# EAGLE design qfp160_socket (EAGLE 9.6.2)
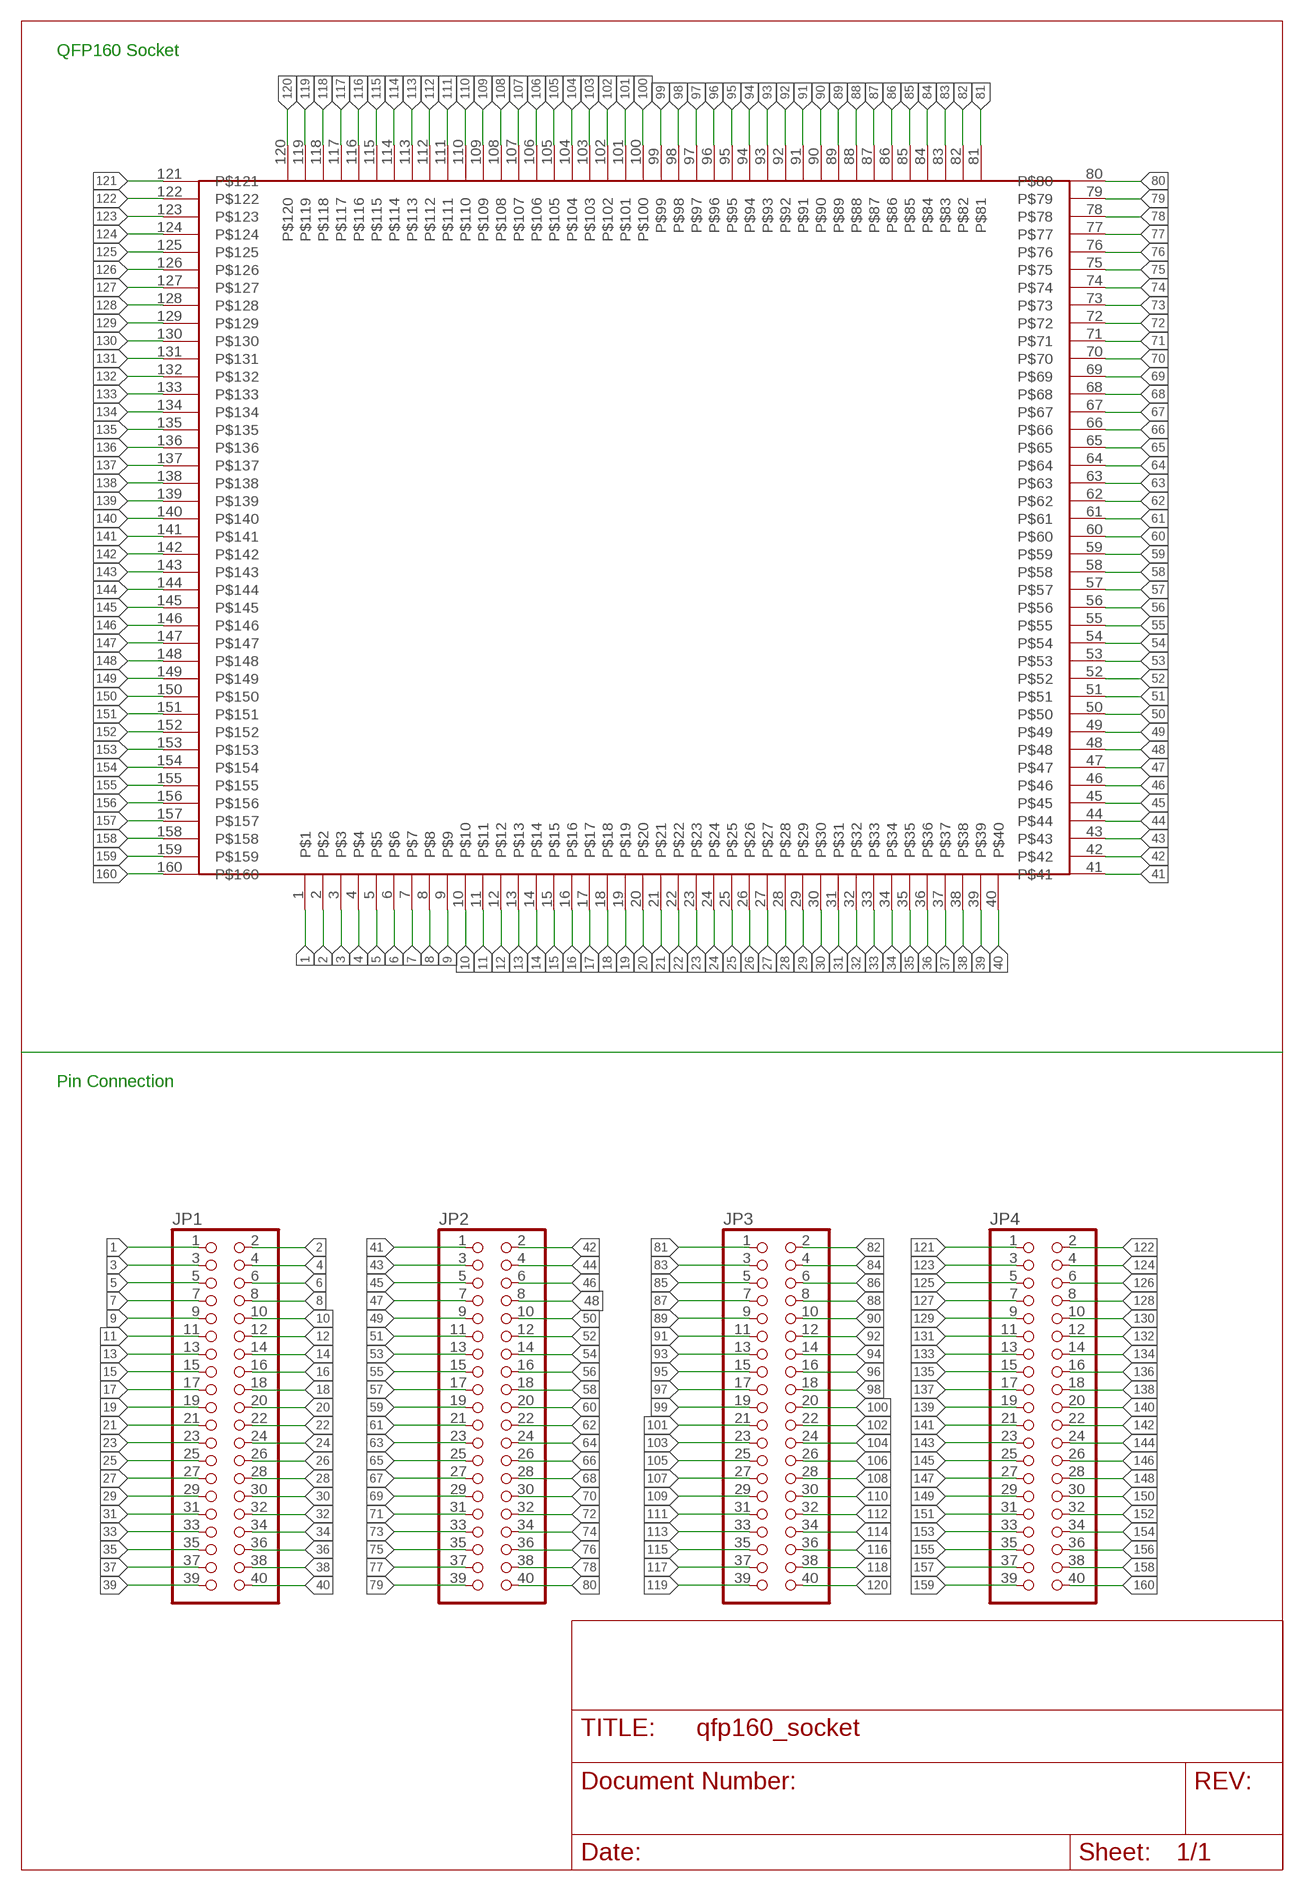
[diagram p0: schematic, sheet 1]

## Parts
JP1  PINHD-2X20  [2X20]
JP2  PINHD-2X20  [2X20]
JP3  PINHD-2X20  [2X20]
JP4  PINHD-2X20  [2X20]
U$1  QFP160_SOCKET  [QFP160_SOCKET]

## Nets
1: JP1.1 U$1.1
2: JP1.2 U$1.2
3: JP1.3 U$1.3
4: JP1.4 U$1.4
5: JP1.5 U$1.5
6: JP1.6 U$1.6
7: JP1.7 U$1.7
8: JP1.8 U$1.8
9: JP1.9 U$1.9
10: JP1.10 U$1.10
11: JP1.11 U$1.11
12: JP1.12 U$1.12
13: JP1.13 U$1.13
14: JP1.14 U$1.14
15: JP1.15 U$1.15
16: JP1.16 U$1.16
17: JP1.17 U$1.17
18: JP1.18 U$1.18
19: JP1.19 U$1.19
20: JP1.20 U$1.20
21: JP1.21 U$1.21
22: JP1.22 U$1.22
23: JP1.23 U$1.23
24: JP1.24 U$1.24
25: JP1.25 U$1.25
26: JP1.26 U$1.26
27: JP1.27 U$1.27
28: JP1.28 U$1.28
29: JP1.29 U$1.29
30: JP1.30 U$1.30
31: JP1.31 U$1.31
32: JP1.32 U$1.32
33: JP1.33 U$1.33
34: JP1.34 U$1.34
35: JP1.35 U$1.35
36: JP1.36 U$1.36
37: JP1.37 U$1.37
38: JP1.38 U$1.38
39: JP1.39 U$1.39
40: JP1.40 U$1.40
41: JP2.1 U$1.41
42: JP2.2 U$1.42
43: JP2.3 U$1.43
44: JP2.4 U$1.44
45: JP2.5 U$1.45
46: JP2.6 U$1.46
47: JP2.7 U$1.47
48: JP2.8 U$1.48
49: JP2.9 U$1.49
50: JP2.10 U$1.50
51: JP2.11 U$1.51
52: JP2.12 U$1.52
53: JP2.13 U$1.53
54: JP2.14 U$1.54
55: JP2.15 U$1.55
56: JP2.16 U$1.56
57: JP2.17 U$1.57
58: JP2.18 U$1.58
59: JP2.19 U$1.59
60: JP2.20 U$1.60
61: JP2.21 U$1.61
62: JP2.22 U$1.62
63: JP2.23 U$1.63
64: JP2.24 U$1.64
65: JP2.25 U$1.65
66: JP2.26 U$1.66
67: JP2.27 U$1.67
68: JP2.28 U$1.68
69: JP2.29 U$1.69
70: JP2.30 U$1.70
71: JP2.31 U$1.71
72: JP2.32 U$1.72
73: JP2.33 U$1.73
74: JP2.34 U$1.74
75: JP2.35 U$1.75
76: JP2.36 U$1.76
77: JP2.37 U$1.77
78: JP2.38 U$1.78
79: JP2.39 U$1.79
80: JP2.40 U$1.80
81: JP3.1 U$1.81
82: JP3.2 U$1.82
83: JP3.3 U$1.83
84: JP3.4 U$1.84
85: JP3.5 U$1.85
86: JP3.6 U$1.86
87: JP3.7 U$1.87
88: JP3.8 U$1.88
89: JP3.9 U$1.89
90: JP3.10 U$1.90
91: JP3.11 U$1.91
92: JP3.12 U$1.92
93: JP3.13 U$1.93
94: JP3.14 U$1.94
95: JP3.15 U$1.95
96: JP3.16 U$1.96
97: JP3.17 U$1.97
98: JP3.18 U$1.98
99: JP3.19 U$1.99
100: JP3.20 U$1.100
101: JP3.21 U$1.101
102: JP3.22 U$1.102
103: JP3.23 U$1.103
104: JP3.24 U$1.104
105: JP3.25 U$1.105
106: JP3.26 U$1.106
107: JP3.27 U$1.107
108: JP3.28 U$1.108
109: JP3.29 U$1.109
110: JP3.30 U$1.110
111: JP3.31 U$1.111
112: JP3.32 U$1.112
113: JP3.33 U$1.113
114: JP3.34 U$1.114
115: JP3.35 U$1.115
116: JP3.36 U$1.116
117: JP3.37 U$1.117
118: JP3.38 U$1.118
119: JP3.39 U$1.119
120: JP3.40 U$1.120
121: JP4.1 U$1.121
122: JP4.2 U$1.122
123: JP4.3 U$1.123
124: JP4.4 U$1.124
125: JP4.5 U$1.125
126: JP4.6 U$1.126
127: JP4.7 U$1.127
128: JP4.8 U$1.128
129: JP4.9 U$1.129
130: JP4.10 U$1.130
131: JP4.11 U$1.131
132: JP4.12 U$1.132
133: JP4.13 U$1.133
134: JP4.14 U$1.134
135: JP4.15 U$1.135
136: JP4.16 U$1.136
137: JP4.17 U$1.137
138: JP4.18 U$1.138
139: JP4.19 U$1.139
140: JP4.20 U$1.140
141: JP4.21 U$1.141
142: JP4.22 U$1.142
143: JP4.23 U$1.143
144: JP4.24 U$1.144
145: JP4.25 U$1.145
146: JP4.26 U$1.146
147: JP4.27 U$1.147
148: JP4.28 U$1.148
149: JP4.29 U$1.149
150: JP4.30 U$1.150
151: JP4.31 U$1.151
152: JP4.32 U$1.152
153: JP4.33 U$1.153
154: JP4.34 U$1.154
155: JP4.35 U$1.155
156: JP4.36 U$1.156
157: JP4.37 U$1.157
158: JP4.38 U$1.158
159: JP4.39 U$1.159
160: JP4.40 U$1.160

## Notes on the sheet
- QFP160 Socket
- Pin Connection

## Library data of the parts
JP1-JP4 = pinhead:PINHD-2X20: PIN HEADER
U$1 = qfp160:QFP160_SOCKET

## Board
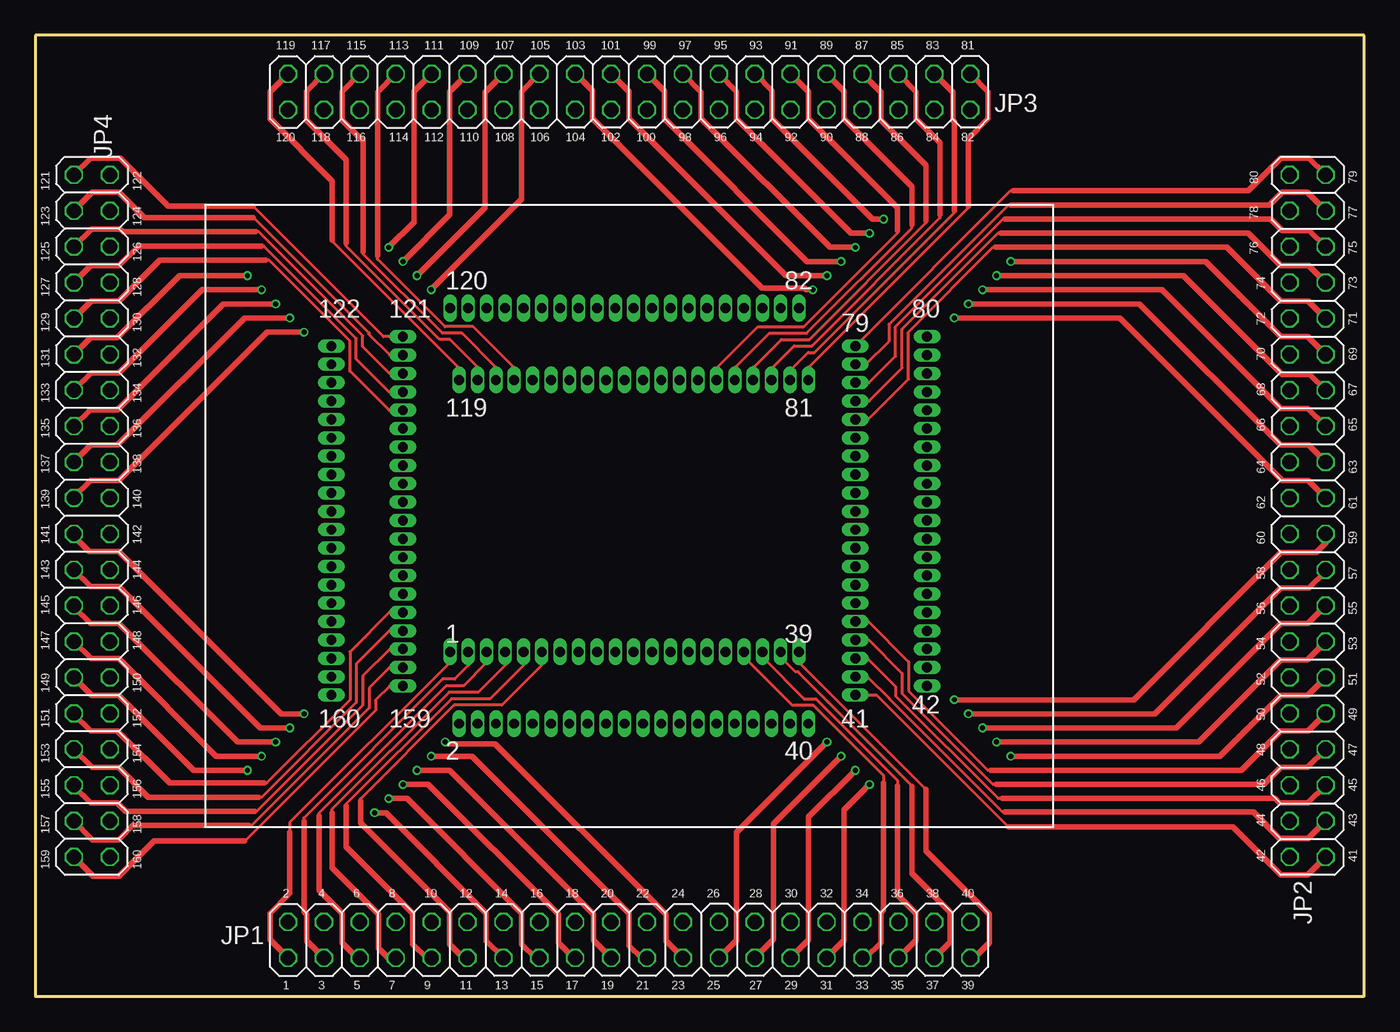
[diagram p1: board, top side]
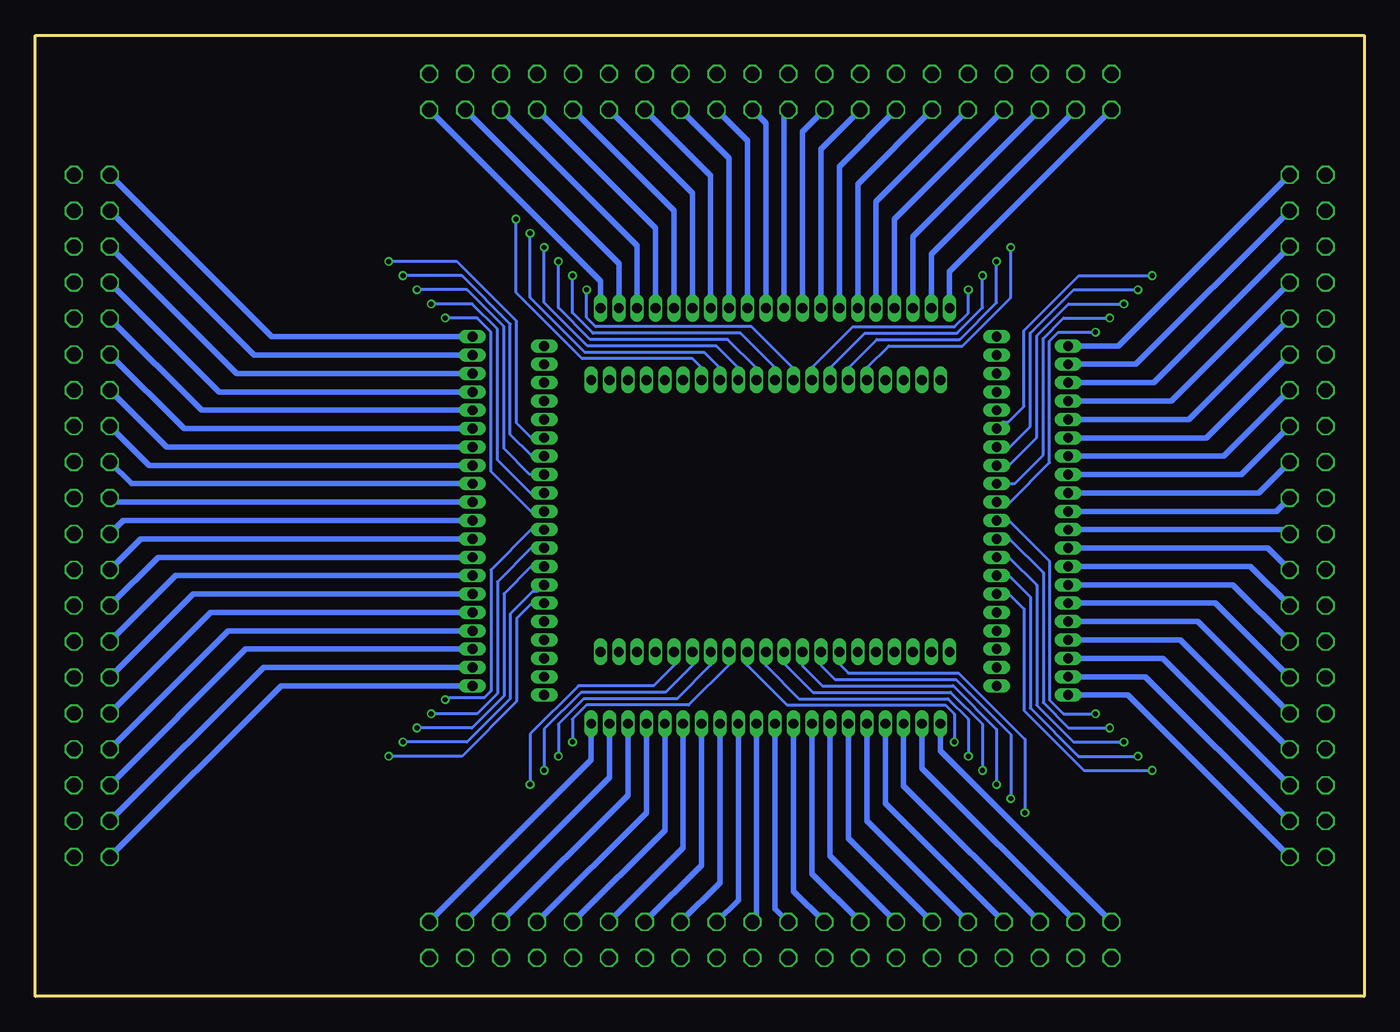
[diagram p2: board, bottom side, seen from below]

Size 94 x 68 mm. Coordinates in mm from the lower left corner, seen from the top.
Outline: 0,68 0,0 94,0 94,68 0,68
Copper layers (1*16): Top 0.035mm / dielectric 1.5mm / Bottom 0.035mm
Design rules "default *": minimum track width 6mil, minimum drill 0.35mm, track to track 10mil, track to pad 10mil, pad to pad 10mil, via to via 10mil, smd to smd 10mil, copper to edge 40mil, drill to drill 6mil, minimum pad ring 0.13mm, minimum via ring 0.13mm, stop-mask expansion 2mil, vias tented up to drill 0mil, thermal gap 10mil

### Footprints (pad centres in the part's own frame; a part is rotated, then mirrored left to right if it is on the bottom)
2X20 = drill 1.016 octagon: 1 -24.13,-1.27; 2 -24.13,1.27; 3 -21.59,-1.27; 4 -21.59,1.27; 5 -19.05,-1.27; 6 -19.05,1.27; 7 -16.51,-1.27; 8 -16.51,1.27; 9 -13.97,-1.27; 10 -13.97,1.27; 11 -11.43,-1.27; 12 -11.43,1.27; 13 -8.89,-1.27; 14 -8.89,1.27; 15 -6.35,-1.27; 16 -6.35,1.27; 17 -3.81,-1.27; 18 -3.81,1.27; 19 -1.27,-1.27; 20 -1.27,1.27; 21 1.27,-1.27; 22 1.27,1.27; 23 3.81,-1.27; 24 3.81,1.27; 25 6.35,-1.27; 26 6.35,1.27; 27 8.89,-1.27; 28 8.89,1.27; 29 11.43,-1.27; 30 11.43,1.27; 31 13.97,-1.27; 32 13.97,1.27; 33 16.51,-1.27; 34 16.51,1.27; 35 19.05,-1.27; 36 19.05,1.27; 37 21.59,-1.27; 38 21.59,1.27; 39 24.13,-1.27; 40 24.13,1.27
QFP160_SOCKET = drill 0.7 pad 0.7 long: 1 -12.675,-9.62; 2 -12.025,-14.7; 3 -11.375,-9.62; 4 -10.725,-14.7; 5 -10.075,-9.62; 6 -9.425,-14.7; 7 -8.775,-9.62; 8 -8.125,-14.7; 9 -7.475,-9.62; 10 -6.825,-14.7; 11 -6.175,-9.62; 12 -5.525,-14.7; 13 -4.875,-9.62; 14 -4.225,-14.7; 15 -3.575,-9.62; 16 -2.925,-14.7; 17 -2.275,-9.62; 18 -1.625,-14.7; 19 -0.975,-9.62; 20 -0.325,-14.7; 21 0.325,-9.62; 22 0.975,-14.7; 23 1.625,-9.62; 24 2.275,-14.7; 25 2.925,-9.62; 26 3.575,-14.7; 27 4.225,-9.62; 28 4.875,-14.7; 29 5.525,-9.62; 30 6.175,-14.7; 31 6.825,-9.62; 32 7.475,-14.7; 33 8.125,-9.62; 34 8.775,-14.7; 35 9.425,-9.62; 36 10.075,-14.7; 37 10.725,-9.62; 38 11.375,-14.7; 39 12.025,-9.62; 40 12.675,-14.7; 41 16,-12.675; 42 21.08,-12.025; 43 16,-11.375; 44 21.08,-10.725; 45 16,-10.075; 46 21.08,-9.425; 47 16,-8.775; 48 21.08,-8.125; 49 16,-7.475; 50 21.08,-6.825; 51 16,-6.175; 52 21.08,-5.525; 53 16,-4.875; 54 21.08,-4.225; 55 16,-3.575; 56 21.08,-2.925; 57 16,-2.275; 58 21.08,-1.625; 59 16,-0.975; 60 21.08,-0.325; 61 16,0.325; 62 21.08,0.975; 63 16,1.625; 64 21.08,2.275; 65 16,2.925; 66 21.08,3.575; 67 16,4.225; 68 21.08,4.875; 69 16,5.525; 70 21.08,6.175; 71 16,6.825; 72 21.08,7.475; 73 16,8.125; 74 21.08,8.775; 75 16,9.425; 76 21.08,10.075; 77 16,10.725; 78 21.08,11.375; 79 16,12.025; 80 21.08,12.675; 81 12.675,9.62; 82 12.025,14.7; 83 11.375,9.62; 84 10.725,14.7; 85 10.075,9.62; 86 9.425,14.7; 87 8.775,9.62; 88 8.125,14.7; 89 7.475,9.62; 90 6.825,14.7; 91 6.175,9.62; 92 5.525,14.7; 93 4.875,9.62; 94 4.225,14.7; 95 3.575,9.62; 96 2.925,14.7; 97 2.275,9.62; 98 1.625,14.7; 99 0.975,9.62; 100 0.325,14.7; 101 -0.325,9.62; 102 -0.975,14.7; 103 -1.625,9.62; 104 -2.275,14.7; 105 -2.925,9.62; 106 -3.575,14.7; 107 -4.225,9.62; 108 -4.875,14.7; 109 -5.525,9.62; 110 -6.175,14.7; 111 -6.825,9.62; 112 -7.475,14.7; 113 -8.125,9.62; 114 -8.775,14.7; 115 -9.425,9.62; 116 -10.075,14.7; 117 -10.725,9.62; 118 -11.375,14.7; 119 -12.025,9.62; 120 -12.675,14.7; 121 -16,12.675; 122 -21.06,12.025; 123 -16,11.375; 124 -21.06,10.725; 125 -16,10.075; 126 -21.06,9.425; 127 -16,8.775; 128 -21.06,8.125; 129 -16,7.475; 130 -21.06,6.825; 131 -16,6.175; 132 -21.06,5.525; 133 -16,4.875; 134 -21.06,4.225; 135 -16,3.575; 136 -21.06,2.925; 137 -16,2.275; 138 -21.06,1.625; 139 -16,0.975; 140 -21.06,0.325; 141 -16,-0.325; 142 -21.06,-0.975; 143 -16,-1.625; 144 -21.06,-2.275; 145 -16,-2.925; 146 -21.06,-3.575; 147 -16,-4.225; 148 -21.06,-4.875; 149 -16,-5.525; 150 -21.06,-6.175; 151 -16,-6.825; 152 -21.06,-7.475; 153 -16,-8.125; 154 -21.06,-8.775; 155 -16,-9.425; 156 -21.06,-10.075; 157 -16,-10.725; 158 -21.06,-11.375; 159 -16,-12.025; 160 -21.06,-12.675

### Placement (x,y rotation side)
JP1  42,4 0 top
JP2  90,34 90 top
JP3  42,64 180 top
JP4  4,34 270 top
U$1  42,34 0 top

### Tracks (layer width: path | path; a pad name or v marks a point on that pad's centre or on a via)
1
  Top 0.2: U$1.1 29.32,23.64 18,12.32 18,11.6
  Top 0.4: JP1.1 16.6,4 16.6,5.9 18,7.3 18,11.6
2
  Bottom 0.4: U$1.2 29.98,17.38 JP1.2
3
  Top 0.2: U$1.3 30.66,24.35 30.66,23.45 29.67,22.47 28.82,22.47 19,12.64 19,12.4
  Top 0.4: JP1.3 19.2,3.94 19.2,5.8 19,6 19,12.4
4
  Bottom 0.4: U$1.4 31.27,16.14 JP1.4
5
  Top 0.2: U$1.5 31.86,24.31 31.86,23.55 30.28,21.98 29.06,21.98 20.09,13 20.09,12.77
  Top 0.4: JP1.5 22.77,2.73 21.7,3.8 21.7,5.9 20.09,7.51 20.09,12.77
6
  Bottom 0.4: U$1.6 32.58,14.89 JP1.6
7
  Top 0.2: U$1.7 33.26,24.35 33.26,23.45 31.33,21.52 29.25,21.52 21,13.27 21,13
  Top 0.4: JP1.7 24.97,2.73 24.3,3.4 24.3,5.8 21,9.1 21,13
8
  Bottom 0.4: U$1.8 33.88,13.66 JP1.8
9
  Top 0.2: U$1.9 34.52,23.42 32.17,21.07 29.44,21.07 22,13.63 22,13.5 22,13.48
  Top 0.4: JP1.9 27.67,2.73 26.7,3.7 26.7,5.9 22,10.6 22,13.48
10
  Bottom 0.4: U$1.10 35.17,12.41 JP1.10
11
  Top 0.2: U$1.11 35.83,23.43 33.01,20.61 29.63,20.61 23,13.98 23,13.84
  Top 0.4: JP1.11 30.27,2.73 29.3,3.7 29.3,6 23,12.3 23,13.84
12
  Bottom 0.4: U$1.12 36.48,11.18 JP1.12
13  (via drill 0.35)
  Top 0.4: v24,13 24.8,13 31.9,5.9 31.9,3.94 JP1.13
  Bottom 0.2: U$1.13 37.12,23.52 36.49,22.88 28.69,22.88 24,18.2 v24,13
14
  Bottom 0.4: U$1.14 37.77,9.93 JP1.14
15  (via drill 0.35)
  Top 0.4: v25,14 26.3,14 34.4,5.9 34.4,3.7 35.37,2.73 JP1.15
  Bottom 0.2: U$1.15 38.42,23.42 37.43,22.43 28.88,22.43 25,18.55 v25,14
16
  Bottom 0.4: U$1.16 39.08,8.7 JP1.16
17  (via drill 0.35)
  Top 0.4: v26,15 27.8,15 37,5.8 37,3.8 38.07,2.73 JP1.17
  Bottom 0.2: U$1.17 39.73,23.38 38.32,21.98 29.06,21.98 26,18.91 v26,15
18
  Bottom 0.4: U$1.18 40.38,7.45 JP1.18
19  (via drill 0.35)
  Top 0.4: v27,16 29.3,16 39.5,5.8 39.5,3.96 JP1.19
  Bottom 0.2: U$1.19 41.02,23.55 39,21.52 29.25,21.52 27,19.27 v27,16
20
  Bottom 0.4: U$1.20 41.67,6.21 JP1.20
21  (via drill 0.35)
  Top 0.4: v28,17 30.9,17 42,5.9 42,3.6 42.87,2.73 JP1.21
  Bottom 0.2: U$1.21 42.33,23.41 39.99,21.07 29.44,21.07 28,19.63 v28,17
22
  Bottom 0.4: U$1.22 42.98,5.57 JP1.22
23  (via drill 0.35)
  Top 0.4: v29,18 29.11,17.89 32.51,17.89 44.6,5.8 44.6,3.94 JP1.23
  Bottom 0.2: U$1.23 43.66,24.35 43.66,23.45 40.82,20.61 29.63,20.61 29,19.98 v29,18
24
  Bottom 0.4: U$1.24 44.27,6.8 JP1.24
25  (via drill 0.35)
  Top 0.4: v56,18 49.6,11.6 49.6,3.98 JP1.25
  Bottom 0.2: U$1.25 44.92,23.48 47.79,20.61 55.02,20.61 56.01,19.62 v56.01,18.01 v56,18
26
  Bottom 0.4: U$1.26 45.58,8.05 JP1.26
27  (via drill 0.35)
  Top 0.4: v57,17 52.2,12.2 52.2,4.04 JP1.27
  Bottom 0.2: U$1.27 46.23,23.44 48.6,21.07 55.21,21.07 57,19.28 v57,17
28
  Bottom 0.4: U$1.28 46.88,9.29 JP1.28
29  (via drill 0.35)
  Top 0.4: v58,16 54.7,12.7 54.7,4 JP1.29
  Bottom 0.2: U$1.29 47.52,23.42 49.42,21.52 55.4,21.52 58,18.92 v58,16
30
  Bottom 0.4: U$1.30 48.17,10.52 JP1.30
31  (via drill 0.35)
  Top 0.4: v59,15 57.2,13.2 57.2,3.96 JP1.31
  Bottom 0.2: U$1.31 48.79,24.35 48.79,23.45 50.27,21.98 55.59,21.98 59,18.56 v59,15
32
  Bottom 0.4: U$1.32 49.48,11.77 JP1.32
33
  Top 0.2: U$1.33 50.09,24.35 50.09,24.05 53.53,20.61 55.02,20.61 60,15.63 60,15.1
  Top 0.4: JP1.33 58.73,2.73 59.8,3.8 59.8,5.9 60,6.1 60,15.1
34
  Bottom 0.4: U$1.34 50.77,13 JP1.34
35
  Top 0.2: U$1.35 51.49,24.31 51.49,23.95 54.38,21.07 55.21,21.07 61,15.28 61,14.9
  Top 0.4: JP1.35 62.3,3.98 62.3,5.9 61,7.2 61,14.9
36
  Bottom 0.4: U$1.36 52.08,14.25 JP1.36
37
  Top 0.2: U$1.37 52.79,24.31 52.79,23.95 53.78,22.97 53.95,22.97 62,14.92 62,14.88
  Top 0.4: JP1.37 64.7,3.84 64.7,6 62,8.7 62,14.88
38
  Bottom 0.4: U$1.38 53.38,15.48 JP1.38
39
  Top 0.2: 63,14.67 54.02,23.64 U$1.39
  Top 0.4: 63,14.67 63,10.3 67.5,5.8 67.5,3.8 66.43,2.73 JP1.39
40
  Bottom 0.4: U$1.40 54.67,16.73 JP1.40
41
  Top 0.2: 68.83,12 59.5,21.32 U$1.41
  Top 0.4: JP2.1 90,8.6 88.1,8.6 84.7,12 68.83,12
42
  Bottom 0.4: U$1.42 76.62,21.98 JP2.2
43
  Top 0.2: 68.6,13.05 68.42,13.05 60.4,21.06 60.4,21.08 58.86,22.62 U$1.43
  Top 0.4: JP2.3 90.06,11.2 88,11.2 86.15,13.05 68.6,13.05
44
  Bottom 0.4: U$1.44 77.87,23.27 JP2.4
45
  Top 0.2: U$1.45 58.07,23.86 58.92,23.86 60.86,21.93 60.86,21.25 68.11,14 68.4,14
  Top 0.4: JP2.5 90.02,13.7 88,13.7 87.7,14 68.4,14
46
  Bottom 0.4: U$1.46 79.1,24.57 JP2.6
47
  Top 0.2: U$1.47 58.03,25.26 58.92,25.26 61.31,22.87 61.31,21.44 67.75,15 68,15
  Top 0.4: JP2.7 89.98,16.2 88.1,16.2 86.9,15 68,15
48
  Bottom 0.4: U$1.48 80.34,25.88 JP2.8
49
  Top 0.2: U$1.49 58.92,26.52 61.77,23.68 61.77,21.63 67.4,16 67.6,16
  Top 0.4: JP2.9 90.04,18.8 88.1,18.8 85.3,16 67.6,16
50
  Bottom 0.4: U$1.50 81.59,27.18 JP2.10
51  (via drill 0.35)
  Top 0.4: v69,17 83.8,17 88.1,21.3 90,21.3 JP2.11
  Bottom 0.2: U$1.51 58.88,27.82 59.95,26.75 59.95,20.88 63.83,17 v69,17
52
  Bottom 0.4: U$1.52 82.83,28.48 JP2.12
53  (via drill 0.35)
  Top 0.4: v68,18 82.3,18 88.1,23.8 89.96,23.8 JP2.13
  Bottom 0.2: U$1.53 58.47,28.66 58.83,28.66 60.4,27.08 60.4,21.06 63.47,18 v68,18
54
  Bottom 0.4: U$1.54 84.06,29.77 JP2.14
55  (via drill 0.35)
  Top 0.4: v67,19 80.7,19 88.1,26.4 90.02,26.4 JP2.15
  Bottom 0.2: U$1.55 58.92,30.43 60.86,28.49 60.86,21.25 63.11,19 v67,19
56
  Bottom 0.4: U$1.56 85.31,31.07 JP2.16
57  (via drill 0.35)
  Top 0.4: v66,20 79.2,20 88.1,28.9 90.1,28.9 91.27,30.07 JP2.17
  Bottom 0.2: U$1.57 58.92,31.73 61.31,29.34 61.31,21.44 62.75,20 v66,20
58
  Bottom 0.4: U$1.58 86.55,32.38 JP2.18
59  (via drill 0.35)
  Top 0.4: v65,21 77.7,21 88.1,31.4 90.6,31.4 91.27,32.07 JP2.19
  Bottom 0.2: U$1.59 58.92,33.02 61.77,30.18 61.77,21.63 62.25,21.14 64.86,21.14 v65,21
60
  Bottom 0.4: U$1.60 87.78,33.67 JP2.20
61  (via drill 0.35)
  Top 0.4: v65,48 76.7,48 88.2,36.5 90.04,36.5 JP2.21
  Bottom 0.2: U$1.61 58.94,34.33 61.77,37.16 61.77,47.02 62.75,48 v65,48
62
  Bottom 0.4: U$1.62 88.44,34.98 JP2.22
63  (via drill 0.35)
  Top 0.4: v66,49 78.1,49 88.1,39 90.08,39 JP2.23
  Bottom 0.2: U$1.63 58.02,35.6 58.95,35.6 61.31,37.96 61.31,47.21 63.1,49 v66,49
64
  Bottom 0.4: U$1.64 87.19,36.27 JP2.24
65  (via drill 0.35)
  Top 0.4: v67,50 79.7,50 88.1,41.6 90.02,41.6 JP2.25
  Bottom 0.2: U$1.65 58.02,36.94 59.02,36.94 60.86,38.77 60.86,47.4 63.46,50 v67,50
66
  Bottom 0.4: U$1.66 85.95,37.58 JP2.26
67  (via drill 0.35)
  Top 0.4: v68,51 81.2,51 88.2,44 90.16,44 JP2.27
  Bottom 0.2: U$1.67 58.88,38.23 60.4,39.75 60.4,47.59 63.82,51 v68,51
68
  Bottom 0.4: U$1.68 84.72,38.88 JP2.28
69  (via drill 0.35)
  Top 0.4: v69,52 82.8,52 88.1,46.7 90,46.7 JP2.29
  Bottom 0.2: U$1.69 58.03,39.49 58.88,39.49 59.95,40.57 59.95,47.77 64.18,52 v69,52
70
  Bottom 0.4: U$1.70 83.47,40.17 JP2.30
71
  Top 0.2: U$1.71 58.91,40.83 61.77,43.68 61.77,47.02 67.75,53 67.9,53
  Top 0.4: JP2.31 90.04,49.2 88.1,49.2 84.3,53 67.9,53
72
  Bottom 0.4: U$1.72 82.23,41.48 JP2.32
73
  Top 0.2: U$1.73 58.98,42.12 61.31,44.46 61.31,47.21 68.1,54 68.3,54
  Top 0.4: JP2.33 90.08,51.7 88.1,51.7 85.8,54 68.3,54
74
  Bottom 0.4: U$1.74 81,42.77 JP2.34
75
  Top 0.2: U$1.75 58.98,43.42 60.86,45.31 60.86,47.4 68.46,55 68.6,55
  Top 0.4: JP2.35 90.12,54.2 88.2,54.2 87.4,55 68.6,55
76
  Bottom 0.4: U$1.76 79.75,44.08 JP2.36
77
  Top 0.2: U$1.77 58.76,44.73 60.4,46.37 60.4,47.59 68.82,56 69,56
  Top 0.4: JP2.37 89.96,56.9 88.2,56.9 87.3,56 69,56
78
  Bottom 0.4: U$1.78 78.52,45.38 JP2.38
79
  Top 0.2: U$1.79 68.97,57 69.2,57
  Top 0.4: JP2.39 90.1,59.3 88.1,59.3 85.8,57 69.2,57
80
  Bottom 0.4: U$1.80 77.28,46.67 JP2.40
81
  Top 0.2: U$1.81 54.73,43.67 54.73,44.53 66,55.8 66,55.9
  Top 0.4: 66,55.9 66,60.7 67.4,62.1 67.4,64 JP3.1
82
  Bottom 0.4: U$1.82 54.02,50.62 JP3.2
83
  Top 0.2: U$1.83 53.34,43.65 53.34,44.24 54.67,45.57 55.12,45.57 65,55.45 65,55.6
  Top 0.4: 65,55.6 65,61.9 64.9,62 64.9,63.96 JP3.3
84
  Bottom 0.4: U$1.84 52.73,51.86 JP3.4
85
  Top 0.2: U$1.85 52.04,43.65 52.04,44.39 53.67,46.02 54.94,46.02 64,55.09 64,55.3
  Top 0.4: 64,55.3 64,60.4 62.3,62.1 62.3,64.02 JP3.5
86
  Bottom 0.4: U$1.86 51.42,53.11 JP3.6
87
  Top 0.2: U$1.87 50.79,43.64 50.79,44.49 52.77,46.48 54.75,46.48 63,54.73 63,54.9
  Top 0.4: 63,54.9 63,58.8 59.8,62 59.8,63.98 JP3.7
88
  Bottom 0.4: U$1.88 50.12,54.34 JP3.8
89
  Top 0.2: U$1.89 49.49,43.64 49.49,44.49 51.93,46.93 54.56,46.93 62,54.37 62,54.6
  Top 0.4: 62,54.6 62,57.3 57.2,62.1 57.2,64.04 JP3.9
90
  Bottom 0.4: U$1.90 48.83,55.59 JP3.10
91
  Top 0.2: U$1.91 48.19,43.64 48.19,44.45 51.13,47.39 54.37,47.39 61,54.02 61,54.2
  Top 0.4: 61,54.2 61,55.8 54.7,62.1 54.7,64 JP3.11
92
  Bottom 0.4: U$1.92 47.52,56.83 JP3.12
93  (via drill 0.35)
  Top 0.4: v60,55 59.2,55 52.1,62.1 52.1,64.1 50.93,65.27 JP3.13
  Bottom 0.2: U$1.93 46.89,43.64 46.89,44.49 47.51,45.12 55.31,45.12 60,49.8 v60,55
94
  Bottom 0.4: U$1.94 46.23,58.06 JP3.14
95  (via drill 0.35)
  Top 0.4: v59,54 57.7,54 49.6,62.1 49.6,64.02 JP3.15
  Bottom 0.2: U$1.95 45.59,43.64 45.59,44.49 46.67,45.57 55.12,45.57 59,49.45 v59,54
96
  Bottom 0.4: U$1.96 44.92,59.3 JP3.16
97  (via drill 0.35)
  Top 0.4: v58,53 56.2,53 47.1,62.1 47.1,63.98 JP3.17
  Bottom 0.2: U$1.97 44.29,43.64 44.29,44.49 45.82,46.02 54.94,46.02 58,49.09 v58,53
98
  Bottom 0.4: U$1.98 43.62,60.55 JP3.18
99  (via drill 0.35)
  Top 0.4: v57,52 54.6,52 44.5,62.1 44.5,64.04 JP3.19
  Bottom 0.2: U$1.99 42.99,43.64 42.99,44.45 45.02,46.48 54.75,46.48 57,48.73 v57,52
100
  Bottom 0.4: U$1.100 42.33,61.78 JP3.20
101  (via drill 0.35)
  Top 0.4: v56,51 53.1,51 42,62.1 42,64 JP3.21
  Bottom 0.2: U$1.101 41.69,43.64 41.69,44.49 44.13,46.93 54.56,46.93 56,48.37 v56,51
102
  Bottom 0.4: U$1.102 41.02,62.44 JP3.22
103  (via drill 0.35)
  Top 0.4: v55,50 54.53,50 54.41,50.11 51.39,50.11 39.4,62.1 39.4,64.1 38.23,65.27 JP3.23
  Bottom 0.2: U$1.103 40.39,43.64 40.39,44.45 43.33,47.39 54.37,47.39 55,48.02 v55,50
104
  Bottom 0.4: U$1.104 39.73,61.2 JP3.24
105  (via drill 0.35)
  Top 0.4: v28,50 34.4,56.4 34.4,64.02 JP3.25
  Bottom 0.2: U$1.105 39.08,44.48 36.17,47.39 28.98,47.39 28,48.37 v28,50
106
  Bottom 0.4: U$1.106 38.42,59.95 JP3.26
107  (via drill 0.35)
  Top 0.4: v27,51 31.8,55.8 31.8,63.96 JP3.27
  Bottom 0.2: U$1.107 37.76,43.64 37.76,44.49 35.32,46.93 28.79,46.93 27,48.72 v27,51
108
  Bottom 0.4: U$1.108 37.12,58.72 JP3.28
109  (via drill 0.35)
  Top 0.4: v26,52 29.3,55.3 29.3,64 JP3.29
  Bottom 0.2: U$1.109 36.46,43.64 36.46,44.49 34.48,46.48 28.6,46.48 26,49.08 v26,52
110
  Bottom 0.4: U$1.110 35.83,57.48 JP3.30
111  (via drill 0.35)
  Top 0.4: v25,53 26.8,54.8 26.8,64.04 JP3.31
  Bottom 0.2: U$1.111 35.12,43.67 35.12,44.53 33.63,46.02 28.41,46.02 25,49.44 v25,53
112
  Bottom 0.4: U$1.112 34.52,56.23 JP3.32
113
  Top 0.2: U$1.113 33.86,43.64 33.86,44.49 30.97,47.39 28.98,47.39 24.2,52.17 24.2,52.4
  Top 0.4: 24.2,52.4 24.2,63.98 JP3.33
114
  Bottom 0.4: U$1.114 33.23,55 JP3.34
115
  Top 0.2: U$1.115 32.61,43.65 32.61,44.49 30.17,46.93 28.79,46.93 23.2,52.52 23.2,52.7
  Top 0.4: 23.2,52.7 23.2,60.5 21.7,62 21.7,64.02 JP3.35
116
  Bottom 0.4: U$1.116 31.93,53.75 JP3.36
117
  Top 0.2: U$1.117 31.27,44.53 29.33,46.48 28.6,46.48 22,53.08 22,53.3
  Top 0.4: 22,53.3 22,59.2 19.2,62 19.2,64.06 JP3.37
118
  Bottom 0.4: U$1.118 30.62,52.52 JP3.38
119
  Top 0.2: 21,53.5 21,53.44 29.98,44.46 U$1.119
  Top 0.4: 21,53.5 21,57.7 16.6,62.1 16.6,64 JP3.39
120
  Bottom 0.4: U$1.120 29.32,51.27 JP3.40
121
  Top 0.2: 15.4,55.9 24.62,46.67 U$1.121
  Top 0.4: 15.4,55.9 9.4,55.9 6,59.3 3.9,59.3 JP4.1
122
  Bottom 0.4: U$1.122 17.38,46.02 JP4.2
123
  Top 0.2: U$1.123 25.98,45.4 25.05,45.4 23.62,46.83 23.62,46.94 15.45,55.1 15.4,55.1
  Top 0.4: 15.4,55.1 7.7,55.1 5.9,56.9 4.04,56.9 JP4.3
124
  Bottom 0.4: U$1.124 16.14,44.73 JP4.4
125
  Top 0.2: U$1.125 25.07,44.08 23.16,45.99 23.16,46.75 15.81,54.1 15.6,54.1
  Top 0.4: 15.6,54.1 6.2,54.1 6,54.3 3.98,54.3 JP4.5
126
  Bottom 0.4: U$1.126 14.89,43.42 JP4.6
127
  Top 0.2: U$1.127 25.02,42.77 22.71,45.09 22.71,46.56 16.17,53.1 16,53.1
  Top 0.4: 16,53.1 7.3,53.1 5.9,51.7 3.92,51.7 JP4.7
128
  Bottom 0.4: U$1.128 13.66,42.12 JP4.8
129
  Top 0.2: U$1.129 25.02,41.48 22.25,44.25 22.25,46.37 16.52,52.1 16.3,52.1
  Top 0.4: 16.3,52.1 8.8,52.1 5.9,49.2 3.96,49.2 JP4.9
130
  Bottom 0.4: U$1.130 12.41,40.83 JP4.10
131  (via drill 0.35)
  Top 0.4: v15,51 10.2,51 5.8,46.6 3.9,46.6 JP4.11
  Bottom 0.2: U$1.131 25.53,40.64 25.18,40.64 24.07,41.75 24.07,47.12 20.19,51 v15,51
132
  Bottom 0.4: U$1.132 11.18,39.52 JP4.12
133  (via drill 0.35)
  Top 0.4: v16,50 11.8,50 5.9,44.1 3.94,44.1 JP4.13
  Bottom 0.2: U$1.133 25.07,38.88 23.62,40.33 23.62,46.94 20.55,50 v16,50
134
  Bottom 0.4: U$1.134 9.94,38.23 JP4.14
135  (via drill 0.35)
  Top 0.4: v17,49 13.3,49 5.8,41.5 3.88,41.5 JP4.15
  Bottom 0.2: U$1.135 25.12,37.58 23.16,39.54 23.16,46.75 20.91,49 v17,49
136
  Bottom 0.4: U$1.136 8.7,36.92 JP4.16
137  (via drill 0.35)
  Top 0.4: v18,48 14.8,48 5.8,39 3.92,39 JP4.17
  Bottom 0.2: U$1.137 25.98,36.29 24.73,36.29 22.71,38.31 22.71,46.56 21.27,48 v18,48
138
  Bottom 0.4: U$1.138 7.45,35.62 JP4.18
139  (via drill 0.35)
  Top 0.4: v19,47 16.4,47 5.9,36.5 3.9,36.5 2.73,35.33 JP4.19
  Bottom 0.2: U$1.139 25.98,34.99 25.02,34.99 22.25,37.76 22.25,46.37 21.62,47 v19,47
140
  Bottom 0.4: U$1.140 6.22,34.33 JP4.20
141  (via drill 0.35)
  Top 0.4: v19,20 17.4,20 5.9,31.5 3.8,31.5 2.73,32.57 JP4.21
  Bottom 0.2: U$1.141 25.12,33.67 22.25,30.8 22.25,20.98 21.27,20 v19,20
142
  Bottom 0.4: U$1.142 5.56,33.02 JP4.22
143  (via drill 0.35)
  Top 0.4: v18,19 15.9,19 5.9,29 3.92,29 JP4.23
  Bottom 0.2: U$1.143 25.09,32.38 22.71,29.99 22.71,20.79 20.92,19 v18,19
144
  Bottom 0.4: U$1.144 6.8,31.73 JP4.24
145  (via drill 0.35)
  Top 0.4: v17,18 14.3,18 5.9,26.4 3.9,26.4 2.73,27.57 JP4.25
  Bottom 0.2: U$1.145 25.12,31.07 23.16,29.11 23.16,20.6 20.56,18 v17,18
146
  Bottom 0.4: U$1.146 8.05,30.43 JP4.26
147  (via drill 0.35)
  Top 0.4: v16,17 12.8,17 5.9,23.9 3.94,23.9 JP4.27
  Bottom 0.2: U$1.147 25.12,29.77 23.62,28.27 23.62,20.41 20.2,17 v16,17
148
  Bottom 0.4: U$1.148 9.28,29.12 JP4.28
149  (via drill 0.35)
  Top 0.4: v15,16 11.2,16 5.9,21.3 4,21.3 JP4.29
  Bottom 0.2: U$1.149 25.12,28.48 24.07,27.42 24.07,20.23 19.84,16 v15,16
150
  Bottom 0.4: U$1.150 10.52,27.82 JP4.30
151
  Top 0.2: U$1.151 25.97,27.21 25.07,27.21 22.25,24.39 22.25,20.98 16.37,15.1 16.2,15.1
  Top 0.4: 16.2,15.1 9.5,15.1 5.8,18.8 3.9,18.8 2.73,19.97 JP4.31
152
  Bottom 0.4: U$1.152 11.77,26.52 JP4.32
153
  Top 0.2: U$1.153 25.97,25.91 25.07,25.91 22.71,23.54 22.71,20.79 16.02,14.1 15.8,14.1
  Top 0.4: 15.8,14.1 8,14.1 5.9,16.2 4.02,16.2 JP4.33
154
  Bottom 0.4: U$1.154 13,25.23 JP4.34
155
  Top 0.2: U$1.155 25.98,24.55 25.05,24.55 23.16,22.66 23.16,20.6 15.66,13.1 15.5,13.1
  Top 0.4: 15.5,13.1 6.4,13.1 5.8,13.7 3.9,13.7 2.73,14.87 JP4.35
156
  Bottom 0.4: U$1.156 14.25,23.93 JP4.36
157
  Top 0.2: U$1.157 25.07,23.27 23.62,21.82 23.62,20.41 15.3,12.1 15.1,12.1
  Top 0.4: 15.1,12.1 6.9,12.1 5.9,11.1 4.04,11.1 JP4.37
158
  Bottom 0.4: U$1.158 15.48,22.62 JP4.38
159
  Top 0.2: U$1.159 25.98,21.95 25.05,21.95 24.07,20.97 24.07,20.23 14.84,11 14.8,11
  Top 0.4: 14.8,11 8.4,11 5.9,8.5 4.1,8.5 JP4.39
160
  Bottom 0.4: U$1.160 16.73,21.32 JP4.40

### Text on the board
tPlace: 119 | 117 | 115 | 113 | 111 | 109 | 107 | 105 | 103 | 101 | 99 | 97 | 95 | 93 | 91 | 89 | 87 | 85 | 83 | 81 | 120 | 118 | 116 | 114 | 112 | 110 | 108 | 106 | 104 | 102 | 100 | 98 | 96 | 94 | 92 | 90 | 88 | 86 | 84 | 82 | 80 | 79 | 121 | 122 | 78 | 77 | 123 | 124 | 125 | 126 | 76 | 75 | 127 | 128 | 74 | 73 | 72 | 71 | 129 | 130 | 70 | 69 | 131 | 132 | 133 | 134 | 68 | 67 | 135 | 136 | 66 | 65 | 137 | 138 | 64 | 63 | 139 | 140 | 62 | 61 | 141 | 142 | 60 | 59 | 143 | 144 | 58 | 57 | 145 | 146 | 56 | 55 | 147 | 148 | 54 | 53 | 149 | 150 | 52 | 51 | 50 | 49 | 151 | 152 | 48 | 47 | 153 | 154 | 155 | 156 | 46 | 45 | 157 | 158 | 44 | 43 | 42 | 41 | 159 | 160 | 2 | 4 | 6 | 8 | 10 | 12 | 14 | 16 | 18 | 20 | 22 | 24 | 26 | 28 | 30 | 32 | 34 | 36 | 38 | 40 | 1 | 3 | 5 | 7 | 9 | 11 | 13 | 15 | 17 | 19 | 21 | 23 | 25 | 27 | 29 | 31 | 33 | 35 | 37 | 39